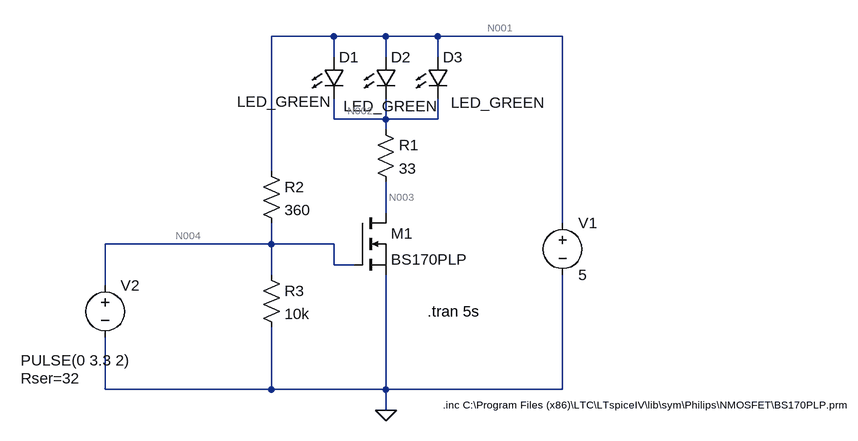
[diagram p0: schematic power_circuit.asc]
power_circuit.asc, the LTspice schematic file:
Version 4
SHEET 1 1068 680
WIRE 176 -144 80 -144
WIRE 256 -144 176 -144
WIRE 336 -144 256 -144
WIRE 528 -144 336 -144
WIRE 176 -112 176 -144
WIRE 256 -112 256 -144
WIRE 336 -112 336 -144
WIRE 176 -16 176 -48
WIRE 256 -16 256 -48
WIRE 256 -16 176 -16
WIRE 336 -16 336 -48
WIRE 336 -16 256 -16
WIRE 256 0 256 -16
WIRE 80 64 80 -144
WIRE 256 128 256 80
WIRE 528 144 528 -144
WIRE 80 176 80 144
WIRE 80 176 -176 176
WIRE 176 176 80 176
WIRE 176 208 176 176
WIRE 208 208 176 208
WIRE 80 224 80 176
WIRE -176 240 -176 176
WIRE -176 400 -176 320
WIRE 80 400 80 304
WIRE 80 400 -176 400
WIRE 256 400 256 224
WIRE 256 400 80 400
WIRE 528 400 528 224
WIRE 528 400 256 400
WIRE 256 432 256 400
FLAG 256 432 0
SYMBOL res 240 -16 R0
SYMATTR InstName R1
SYMATTR Value 33
SYMATTR SpiceLine tol=5 pwr=0.5
SYMBOL res 64 48 R0
SYMATTR InstName R2
SYMATTR Value 360
SYMATTR SpiceLine tol=5 pwr=0.25
SYMBOL res 64 208 R0
SYMATTR InstName R3
SYMATTR Value 10k
SYMATTR SpiceLine tol=5 pwr=0.25
SYMBOL voltage 528 128 R0
WINDOW 123 0 0 Left 2
WINDOW 39 0 0 Left 2
SYMATTR InstName V1
SYMATTR Value 5
SYMBOL voltage -176 224 R0
WINDOW 123 0 0 Left 2
WINDOW 39 -130 159 Left 2
WINDOW 3 -130 131 Left 2
SYMATTR SpiceLine Rser=32
SYMATTR Value PULSE(0 3.3 2)
SYMATTR InstName V2
SYMBOL nmos 208 128 R0
SYMATTR InstName M1
SYMATTR Value BS170PLP
SYMATTR Prefix X
SYMBOL LED 160 -112 R0
WINDOW 3 -133 69 Left 2
SYMATTR Value LED_GREEN
SYMATTR InstName D1
SYMBOL LED 240 -112 R0
WINDOW 3 -49 76 Left 2
SYMATTR Value LED_GREEN
SYMATTR InstName D2
SYMBOL LED 320 -112 R0
WINDOW 3 36 70 Left 2
SYMATTR Value LED_GREEN
SYMATTR InstName D3
TEXT 320 280 Left 2 !.tran 5s
TEXT 344 424 Left 1 !.inc C:\\Program Files (x86)\\LTC\\LTspiceIV\\lib\\sym\\Philips\\NMOSFET\\BS170PLP.prm

The netlist it stands for:
* power_circuit.asc
R1 N002 N003 33 tol=5 pwr=0.5
R2 N001 N004 360 tol=5 pwr=0.25
R3 N004 0 10k tol=5 pwr=0.25
V1 N001 0 5
V2 N004 0 PULSE(0 3.3 2) Rser=32
XM1 N003 N004 0 BS170PLP  ; pins D G S
D1 N001 N002 LED_GREEN
D2 N001 N002 LED_GREEN
D3 N001 N002 LED_GREEN
.model D D
.lib standard.dio
.tran 5s
.inc C:\Program Files (x86)\LTC\LTspiceIV\lib\sym\Philips\NMOSFET\BS170PLP.prm
.backanno
.end

* Results of the author's LTspice run, read from the files saved beside the schematic
* Operating Point, zero values left out:
*   V(n002) = 4.074 V
*   V(n003) = 4.074 V
*   V(n001) = 5 V
*   V(n004) = 407 mV
*   I(D3) = 6.857 pA
*   I(D2) = 6.857 pA
*   I(D1) = 6.857 pA
*   I(R3) = 40.7 µA
*   I(R2) = 12.76 mA
*   I(R1) = 20.57 pA
*   I(V2) = 12.72 mA
*   I(V1) = -12.76 mA
*   Ix(m1:1) = 20.53 pA
*   Ix(m1:3) = -20.53 pA
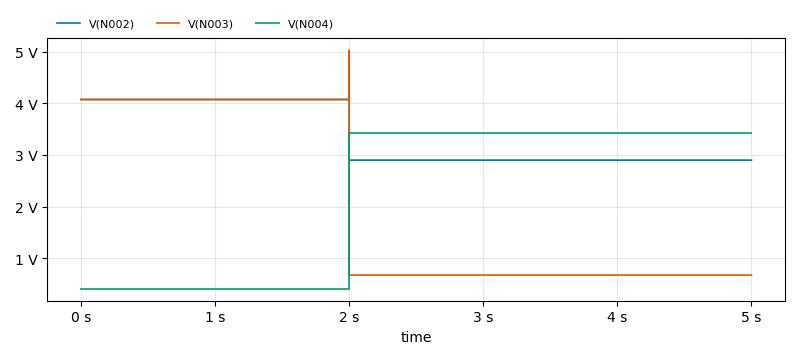
[diagram p1: Transient Analysis of power_circuit.asc, plotted from the saved traces]
* Transient Analysis, 1 run:
*   V(N002): min 2.899 V, max 5.026 V, average 3.369 V, rms 3.418 V, last 2.899 V
*   V(N003): min 673 mV, max 5.026 V, average 2.033 V, rms 2.629 V, last 673 mV
*   V(N004): min 407 mV, max 3.429 V, average 2.22 V, rms 2.668 V, last 3.429 V